# EAGLE design NT_SolarModule1 (EAGLE 9.2.0)
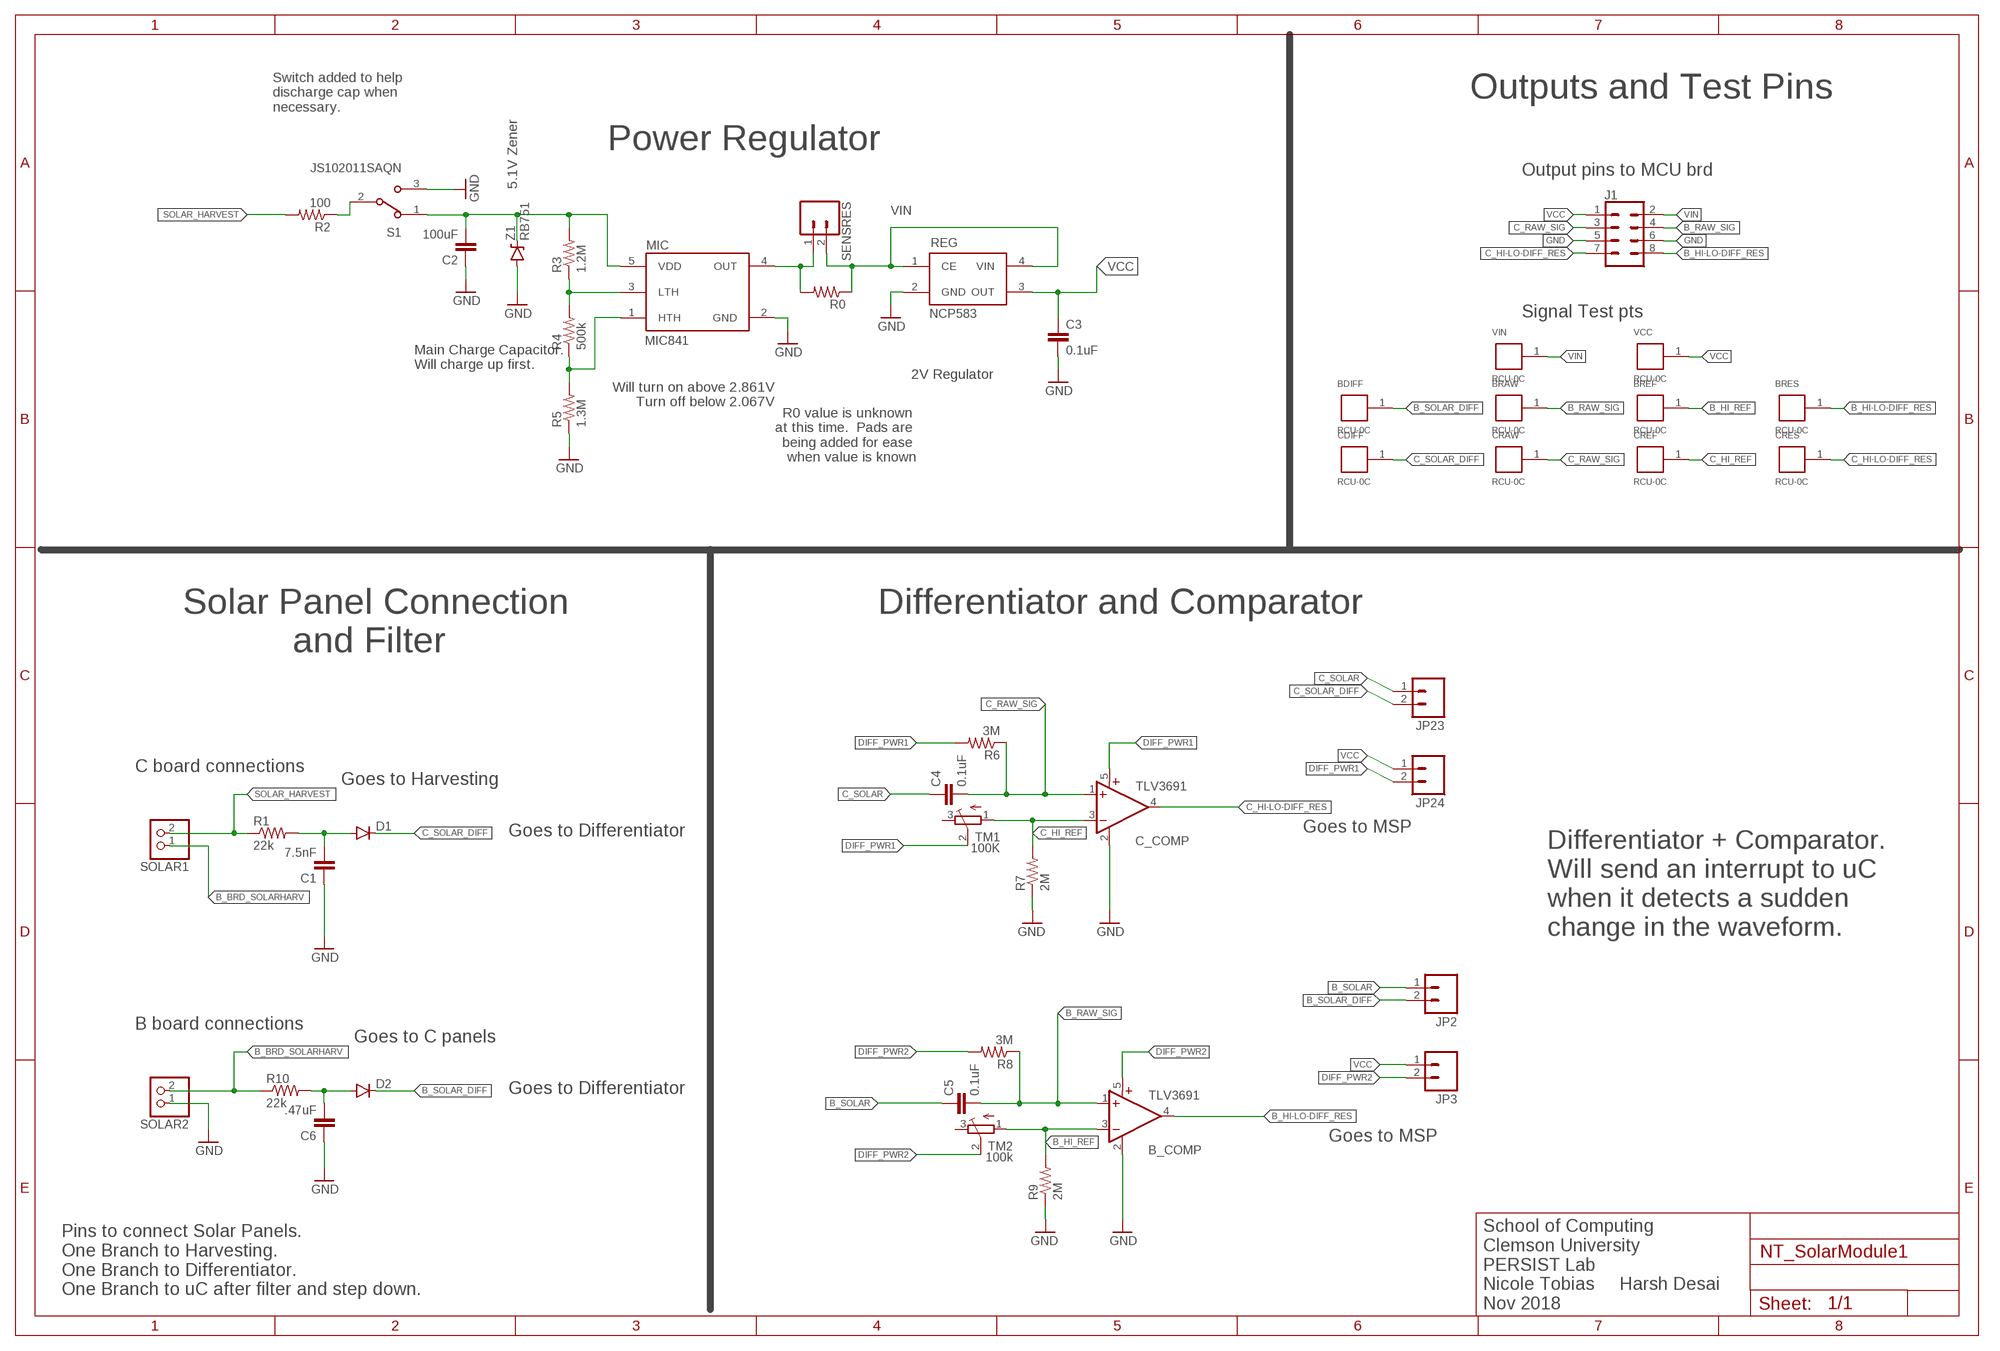
[diagram p0: schematic, sheet 1]

## Parts
B_COMP  TLV3691  [SC70-5]
BDIFF  RCU-0C  [TE_RCU-0C]
BRAW  RCU-0C  [TE_RCU-0C]
BREF  RCU-0C  [TE_RCU-0C]
BRES  RCU-0C  [TE_RCU-0C]
C1  7.5nF  CAP0603-CAP  [0603-CAP]
C2  100uF  CAP0603-CAP  [0603-CAP]
C3  0.1uF  CAP0603-CAP  [0603-CAP]
C4  0.1uF  CAP0603-CAP  [0603-CAP]
C5  0.1uF  CAP0603-CAP  [0603-CAP]
C6  .47uF  CAP0603-CAP  [0603-CAP]
C_COMP  TLV3691  [SC70-5]
CDIFF  RCU-0C  [TE_RCU-0C]
CRAW  RCU-0C  [TE_RCU-0C]
CREF  RCU-0C  [TE_RCU-0C]
CRES  RCU-0C  [TE_RCU-0C]
D1  DIODESOD523  [SOD523]
D2  DIODESOD523  [SOD523]
J1  CONN_04X2  [2X4]
JP2  M02  [1X02-1.27MM]
JP3  M02  [1X02-1.27MM]
JP23  M02  [1X02-1.27MM]
JP24  M02  [1X02-1.27MM]
MIC  MIC841  [SC70-5]
R0  RESISTOR0603  [0603-RES]
R1  22k  RESISTOR0603  [0603-RES]
R2  100  RESISTOR0603  [0603-RES]
R3  1.2M  RESISTOR0603  [0603-RES]
R4  500k  RESISTOR0603  [0603-RES]
R5  1.3M  RESISTOR0603  [0603-RES]
R6  3M  RESISTOR0603  [0603-RES]
R7  2M  RESISTOR0603  [0603-RES]
R8  3M  RESISTOR0603  [0603-RES]
R9  2M  RESISTOR0603  [0603-RES]
R10  22k  RESISTOR0603  [0603-RES]
REG  NCP583  [SC82-AB_1PRIMARY]
S1  JS102011SAQN  [SW_JS102011SAQN]
SENSRES  CONN_02  [1X02]
SOLAR1  PINHD-1X2  [1X02]
SOLAR2  PINHD-1X2  [1X02]
TM1  100K  TRIMPOTTC33X  [TC33X]
TM2  100k  TRIMPOTTC33X  [TC33X]
VCC  RCU-0C  [TE_RCU-0C]
VIN  RCU-0C  [TE_RCU-0C]
Z1  RB751  DIODE-ZENER  [SOD-523]

## Nets
B_BRD_SOLARHARV: R10.1 SOLAR1.1 SOLAR2.2
B_HI-LO-DIFF_RES: B_COMP.4(OUT) BRES.1 J1.8
B_HI_REF: B_COMP.3(-IN) BREF.1 R9.2 TM2.1(A)
B_RAW_SIG: B_COMP.1(+IN) BRAW.1 C5.2 J1.4 R8.1
B_SOLAR: C5.1 JP2.1
B_SOLAR_DIFF: BDIFF.1 D2.C JP2.2
C_HI-LO-DIFF_RES: C_COMP.4(OUT) CRES.1 J1.7
C_HI_REF: C_COMP.3(-IN) CREF.1 R7.2 TM1.1(A)
C_RAW_SIG: C4.2 C_COMP.1(+IN) CRAW.1 J1.3 R6.1
C_SOLAR: C4.1 JP23.1
C_SOLAR_DIFF: CDIFF.1 D1.C JP23.2
DIFF_PWR1: C_COMP.5(V+) JP24.2 R6.2 TM1.2(S)
DIFF_PWR2: B_COMP.5(V+) JP3.2 R8.2 TM2.2(S)
GND: B_COMP.2(GND) C1.1 C2.1 C3.2 C6.1 C_COMP.2(GND) J1.5 J1.6 MIC.2(GND) R5.1 R7.1 R9.1 REG.2(GND) S1.3 SOLAR2.1 Z1.ANODE(A)
MIC_INPUT: C2.2 MIC.5(VDD) R3.2 S1.1 Z1.CATHODE(C)
N$1: C6.2 D2.A R10.2
N$2: C1.2 D1.A R1.2
N$3: MIC.4(OUT) R0.2 SENSRES.1
N$6: R2.1 S1.2
N$11: MIC.3(LTH) R3.1 R4.2
N$12: MIC.1(HTH) R4.1 R5.2
SOLAR_HARVEST: R1.1 R2.2 SOLAR1.2
VCC: C3.1 J1.1 JP3.1 JP24.1 REG.3(OUT) VCC.1
VIN: J1.2 R0.1 REG.1(CE) REG.4(VIN) SENSRES.2 VIN.1
Unconnected: TM1.3(E) TM2.3(E)

## Notes on the sheet
- Outputs and Test Pins
- Switch added to help 
  discharge cap when 
  necessary.
- Power Regulator
- Output pins to MCU brd
- 5.1V Zener
- Signal Test pts
- Main Charge Capacitor.
  Will charge up first.
- 2V Regulator
- Will turn on above 2.861V
  Turn off below 2.067V
- R0 value is unknown 
  at this time.  Pads are 
  being added for ease 
  when value is known
- Differentiator and Comparator
- Solar Panel Connection
             and Filter
- C board connections
- Goes to Harvesting
- Goes to Differentiator | Goes to MSP
- Differentiator + Comparator.
  Will send an interrupt to uC 
  when it detects a sudden 
  change in the waveform.
- B board connections
- Goes to C panels
- Goes to Differentiator
- Goes to MSP
- Pins to connect Solar Panels.
  One Branch to Harvesting.
  One Branch to Differentiator.
  One Branch to uC after filter and step down.
- School of Computing
  Clemson University
  PERSIST Lab
  Nicole Tobias     Harsh Desai
  Nov 2018

## Library data of the parts
B_COMP C_COMP = fedpower:TLV3691: 0.9-V to 6.5-V, Nanopower Comparator Datasheets Analog Signal Chain Guide <http://www.ti.com/lit/pdf/slyb174> TLV3691 <http://www.ti.com/lit/ds/symlink/tlv3691.pdf> Manufacturer Product Page TLV3691IDPFR Specifications <http://www.ti.com/general/docs/suppproductinfo.tsp?distId=10&orderablePartNumber=TLV3691IDPFR> Standard Package <javascript:dlgHelp('Standard%20Packaging%20Help');> 1 Category Integrated Circuits (ICs) </product-search/en/integrated-circuits-ics> Family Linear - Comparators </product-search/en/integrated-circuits-ics/linear-comparators/2556221> Series - Packaging <javascript:dlgHelp('Standard%20Packaging%20Help');> Cut Tape (CT) <javascript:dlgHelp('Cut%20Tape%20Help');> Type General Purpose Number of Elements 1 Output Type Push-Pull Voltage - Supply, Single/Dual (±) 0.9 V ~ 6.5 V, ±0.45 V ~ 3.25 V Voltage - Input Offset (Max) 3mV Current - Input Bias (Max) 100pA Current - Output (Typ) 42mA Current - Quiescent (Max) 150nA CMRR, PSRR (Typ) - Propagation Delay (Max) 35µs Hysteresis - Operating Temperature -40°C ~ 125°C Package / Case 6-XFDFN Mounting Type Surface Mount Supplier Device Package 6-X2SON (1x1) Online Catalog Comparators - 1 element </catalog/en/partgroup/comparators-1-element/3112?mpart=TLV3691IDPFR&vendor=296&WT.z_ref_page_type=PS&WT.z_ref_page_sub_type=PD&WT.z_ref_page_id=PD&WT.z_ref_page_event=DC_Link_Table> Other Names 296-37242-1
BDIFF BRAW BREF BRES CDIFF CRAW CREF CRES VCC VIN = RCU-0C:RCU-0C: 0603 PROBE PAD; AVAILABILITY: Unavailable; COMMENT: RCU-0C _1625854-3_; DESCRIPTION: 0603 PROBE PAD; EU_ROHS_COMPLIANCE: Compliant; LINK: http://www.te.com/usa-en/product-1625854-3.html; MF: TE Connectivity; MP: RCU-0C; PACKAGE: 0603; POWER_RATING: 0 W; PRICE: None; RESISTANCE: <.05; TOLERANCE: 0%
C1-C6 = SparkFun-Capacitors:CAP: Capacitor Standard 0603 ceramic capacitor, and 0.1" leaded capacitor.
D1 D2 = SparkFun-DiscreteSemi:DIODE: Diode These are standard reverse protection diodes and small signal diodes. SMA package can handle up to about 1A. SOD-323 can handle about 200mA. What the SOD-323 package when ordering, there are some mfgs out there that are 5-pin packages.
J1 = SparkFun-Connectors:CONN_04X2: Multi connection point. Often used as Generic Header-pin footprint for 0.1 inch spaced/style header connections On any of the 0.1 inch spaced packages, you can populate with these: Break Away Headers - Straight <https://www.sparkfun.com/products/116> (PRT-00116) Break Away Male Headers - Right Angle <https://www.sparkfun.com/products/553> (PRT-00553) Female Headers <https://www.sparkfun.com/products/115> (PRT-00115) Break Away Headers - Machine Pin <https://www.sparkfun.com/products/117> (PRT-00117) Break Away Female Headers - Swiss Machine Pin <https://www.sparkfun.com/products/743> (PRT-00743)
JP2 JP3 JP23 JP24 = SparkFun-Connectors:M02: Standard 2-pin 0.1" header. Use with - straight break away headers ( PRT-00116) - right angle break away headers (PRT-00553) - swiss pins (PRT-00743) - machine pins (PRT-00117) - female headers (PRT-00115) Molex polarized connector foot print use with: PRT-08233 with associated crimp pins and housings. 2.54_SCREWTERM for use with PRT-10571. 3.5mm Screw Terminal footprints for PRT-08084 5mm Screw Terminal footprints for use with PRT-08432
MIC = mic841:MIC841: MIC841:Comparator with reference and adj. hysteresis
R0 R1-R10 = SparkFun-Resistors:RESISTOR: Resistor Basic schematic elements and footprints for 0603, 1206, and PTH resistors.
REG = ncp583:NCP583: NCP583 - Ultra-Low Iq 150 mA CMOS LDO Regulator with Enable The NCP583 series of low dropout regulators are designed for portable battery powered applications which require precise output voltage accuracy and low quiescent current. These devices feature an enable function which lowers current consumption significantly and are offered in two small packages; SC−82AB and the SOT−563. A 1.0 mF ceramic capacitor is the recommended value to be used with these devices on the output pin.
S1 = JS102011SAQN:JS102011SAQN: JS10 Series SPDT On-On 6 V 0.3 A Gull Wing SMT Slide Switch http://www.snapeda.com/parts/JS102011SAQN/C%26K%20Components/view-part/; AVAILABILITY: Good; DESCRIPTION: SWITCH SLIDE SPDT 300MA 6V; MF: C&K Components; MP: JS102011SAQN; PACKAGE: None; PRICE: 0.35 USD
SENSRES = SparkFun-Connectors:CONN_02: Multi connection point. Often used as Generic Header-pin footprint for 0.1 inch spaced/style header connections On any of the 0.1 inch spaced packages, you can populate with these: Break Away Headers - Straight <https://www.sparkfun.com/products/116> (PRT-00116) Break Away Male Headers - Right Angle <https://www.sparkfun.com/products/553> (PRT-00553) Female Headers <https://www.sparkfun.com/products/115> (PRT-00115) Break Away Headers - Machine Pin <https://www.sparkfun.com/products/117> (PRT-00117) Break Away Female Headers - Swiss Machine Pin <https://www.sparkfun.com/products/743> (PRT-00743) For SCREWTERMINALS and SPRING TERMINALS visit here: Screw Terimnals on SparkFun.com <https://www.sparkfun.com/search/results?term=Screw+Terminals> (5mm/3.5mm/2.54mm spacing) This device is also useful as a general connection point to wire up your design to another part of your project. Our various solder wires solder well into these plated through hole pads. Hook-Up Wire - Assortment (Stranded, 22 AWG) <https://www.sparkfun.com/products/11375> (PRT-11375) Hook-Up Wire - Assortment (Solid Core, 22 AWG) <https://www.sparkfun.com/products/11367> (PRT-11367) View the entire wire category on our website here <https://www.sparkfun.com/categories/141> Special notes: Molex polarized connector foot print use with: PRT-08233 with associated crimp pins and housings. 2.54_SCREWTERM for use with PRT-10571. 3.5mm Screw Terminal footprints for PRT-08084 5mm Screw Terminal footprints for use with PRT-08432
SOLAR1 SOLAR2 = pinhead:PINHD-1X2: PIN HEADER
TM1 TM2 = adafruit:TRIMPOT: SMT trimmer potentiometer part number TC33X http://www.ladyada.net/library/eagle
Z1 = Parts:DIODE-ZENER: Zener Diode Production Part - 8199 3.4V Zener Voltage

## Board
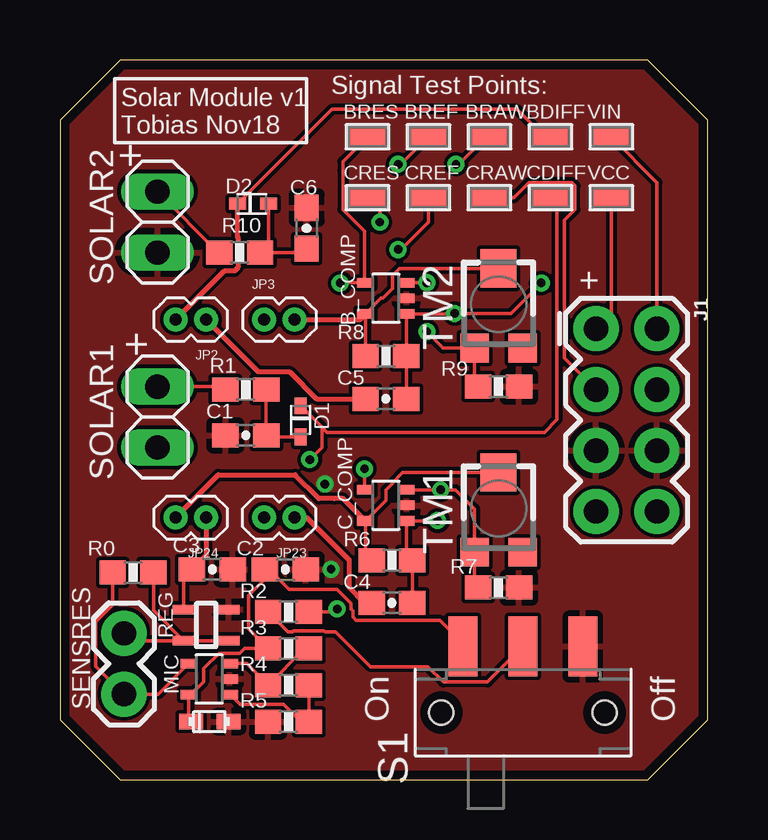
[diagram p1: board, top side]
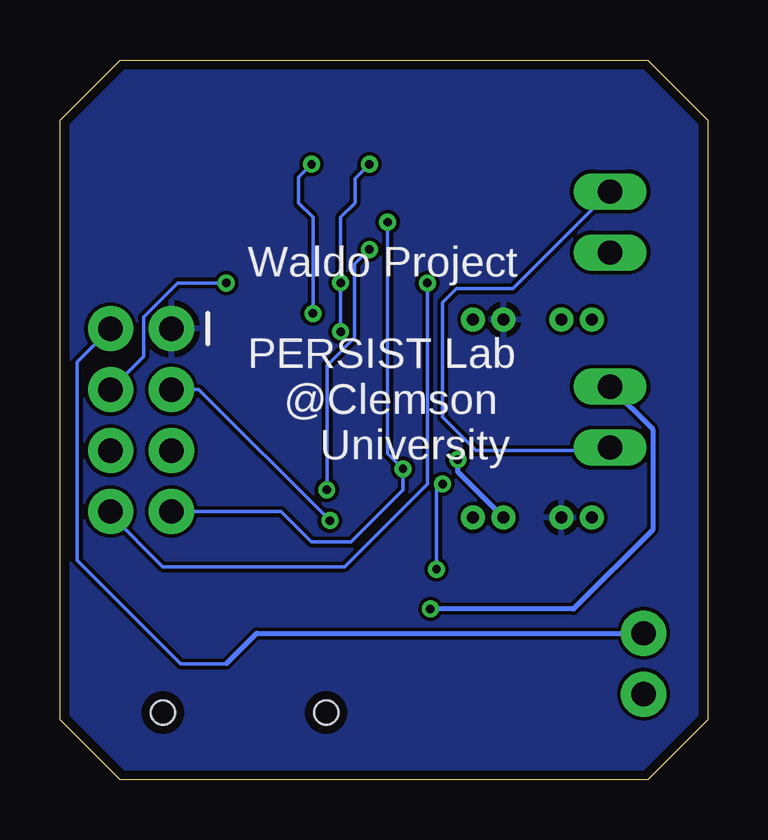
[diagram p2: board, bottom side, seen from below]

Size 27 x 30 mm. Coordinates in mm from the lower left corner, seen from the top.
Outline: 2.5,0 24.5,0 27,2.5 27,27.5 24.5,30 2.5,30 0,27.5 0,2.5 2.5,0
Copper layers (1*16): Top 0.0356mm / dielectric 1.5011mm / Bottom 0.0356mm
Design rules "oshpark-2layer *": minimum track width 6mil, minimum drill 13mil, track to track 6mil, track to pad 6mil, pad to pad 6mil, via to via 6mil, smd to smd 6mil, copper to edge 15mil, drill to drill 6mil, minimum pad ring 7mil, minimum via ring 7mil, stop-mask expansion 2.5mil, vias tented up to drill 14mil, thermal gap 10mil

### Footprints (pad centres in the part's own frame; a part is rotated, then mirrored left to right if it is on the bottom)
SC70-5 = smd 0.4 x 0.7: 1 -0.65,-0.85; 2 0,-0.85; 3 0.65,-0.85; 4 0.65,0.85; 5 -0.65,0.85
TE_RCU-0C = smd 1.6 x 0.8: 1 0,0
0603-CAP = smd 1.1 x 1: 1 -0.85,0; 2 0.85,0
SOD523 = smd 0.7 x 0.5: A 0.7,0; C -0.6,0
2X4 = drill 1.016 pad 1.88: 1 -3.81,-1.27; 2 -3.81,1.27; 3 -1.27,-1.27; 4 -1.27,1.27; 5 1.27,-1.27; 6 1.27,1.27; 7 3.81,-1.27; 8 3.81,1.27
1X02-1.27MM = drill 0.508 pad 1: 1 0,0; 2 1.27,0
0603-RES = smd 1.1 x 1: 1 -0.85,0; 2 0.85,0
SC82-AB_1PRIMARY = smd 0.406 x 0.914: 1 -1.321,-0.813; 2 -0.025,-0.813; 3 -0.025,1.067; 4 -1.321,1.067
SW_JS102011SAQN = smd 1.2 x 2.5: 1 -2.5,2.75; 2 0,2.75; 3 2.5,2.75 | hole 1: -3.4,0; 3.4,0
1X02 = drill 1.016 pad 1.88: 1 0,0; 2 2.54,0
1X02' = drill 1.016 long: 1 -1.27,0; 2 1.27,0
TC33X = smd 1.2 x 1.2: 1 -1,-1.825; 3 1,-1.825 | smd 1.5 x 1.6: 2 0,1.5
SOD-523 = smd 1 x 0.635: ANODE -0.8,0; CATHODE 0.76,0

### Placement (x,y rotation side)
B_COMP  13.59,20.07 90 top
BDIFF  20.45,26.8 0 top
BRAW  17.91,26.8 0 top
BREF  15.37,26.8 0 top
BRES  12.83,26.8 0 top
C1  7.75,14.35 0 top
C2  9.4,8.76 180 top
C3  6.35,8.76 0 top
C4  13.84,7.37 0 top
C5  13.59,15.88 0 top
C6  10.29,22.99 270 top
C_COMP  13.59,11.43 90 top
CDIFF  20.45,24.26 0 top
CRAW  17.91,24.26 0 top
CREF  15.37,24.26 0 top
CRES  12.83,24.26 0 top
D1  10.03,14.99 270 top
D2  8,24 0 top
J1  23.62,14.99 270 top
JP2  6.1,19.18 180 top
JP3  8.51,19.18 0 top
JP23  9.78,10.92 180 top
JP24  6.1,10.92 180 top
MIC  6.22,4.19 90 top
R0  3.05,8.64 180 top
R1  7.75,16.26 0 top
R2  9.53,6.99 0 top
R3  9.53,5.46 180 top
R4  9.53,3.94 180 top
R5  9.53,2.41 0 top
R6  13.84,9.14 180 top
R7  18.29,8 180 top
R8  13.59,17.65 180 top
R9  18.29,16.38 180 top
R10  7.49,21.97 0 top
REG  6.22,7.11 90 top
S1  19.3,2.79 0 top
SENSRES  2.67,3.56 90 top
SOLAR1  [1X02']  4.06,15.11 90 top
SOLAR2  [1X02']  4.06,23.24 90 top
TM1  18.29,11.3 0 top
TM2  18.29,19.81 0 top
VCC  22.99,24.26 0 top
VIN  22.99,26.8 0 top
Z1  6.22,2.41 180 top

### Tracks (layer width: path | path; a pad name or v marks a point on that pad's centre or on a via)
B_BRD_SOLARHARV
  Top 0.152: SOLAR2.2 6.6,21.97 R10.1
  Bottom 0.152: SOLAR1.1 4.19,13.72 9.65,13.72 11.05,15.11 11.05,19.88 10.47,20.46 8.12,20.46 SOLAR2.2
B_HI-LO-DIFF_RES  (via drill 0.35)
  Top 0.152: B_COMP.4 12.7,20.72 | 12.7,20.72 11.7,20.72 v11.68,20.7 | 12.7,20.72 12.7,22.86 11.8,23.76 11.8,25.4 11.8,25.77 BRES.1
  Bottom 0.152: v11.68,20.7 11.68,12.32 15.14,8.87 22.71,8.87 24.89,11.05 J1.8
B_HI_REF  (via drill 0.35)
  Top 0.152: v15.29,20.72 B_COMP.3 | v15.29,18.67 15.98,17.99 TM2.1 17.29,16.53 R9.2 | BREF.1 14.22,25.65 v14.1,25.65
  Bottom 0.152: v15.29,18.67 v15.29,20.72 15.29,23.44 14.71,24.03 14.71,25.04 v14.1,25.65
B_RAW_SIG  (via drill 0.35)
  Top 0.152: C5.2 R8.1 B_COMP.1 16.44,19.42 v16.46,19.43 18.8,19.43 v20.07,20.7 | BRAW.1 17.78,26.8 16.64,25.65 v16.51,25.65
  Bottom 0.152: v16.46,19.43 16.46,23.44 17.04,24.03 17.04,25.12 v16.51,25.65 | J1.4 23.52,17.63 23.52,19.28 22.1,20.7 v20.07,20.7
B_SOLAR
  Top 0.203: JP2.1 8.26,17.01 9.57,17.01 10.7,15.88 C5.1
B_SOLAR_DIFF
  Top 0.152: BDIFF.1 20.19,26.8 19.05,27.94 11.34,27.94 D2.C
  Top 0.203: D2.C 7.4,22.62 7.45,22.58 7.45,21.37 7.3,21.22 6.87,21.22 JP2.2
C_HI-LO-DIFF_RES  (via drill 0.35)
  Top 0.152: C_COMP.4 12.7,12.12 v12.7,12.95 | CRES.1 13.34,23.75 v13.34,23.24
  Bottom 0.152: J1.7 17.78,11.18 16.51,9.91 14.86,9.91 12.7,12.06 v12.7,12.95 13.34,13.59 v13.34,23.24
C_HI_REF  (via drill 0.35)
  Top 0.152: R7.2 17.29,8.15 TM1.1 17.29,11.29 16.5,12.08 v15.88,12.08 C_COMP.3 | CREF.1 15.37,23.24 14.1,21.97 v14.1,22.1
  Bottom 0.152: v14.1,22.1 14.71,21.48 14.71,18.43 15.88,17.27 v15.88,12.08
C_RAW_SIG  (via drill 0.35)
  Top 0.152: C4.2 R6.1 14.44,9.45 C_COMP.1 15.73,10.78 v15.75,10.79 | J1.3 21.03,17.58 21.03,23.32 21.48,23.76 21.48,24.75 21.34,24.89 19.55,24.89 18.92,24.26 CRAW.1
  Bottom 0.152: J1.3 21.21,16.26 v15.75,10.79
C_SOLAR
  Top 0.203: C4.1 12.7,7.37 12.06,8 12.06,9.14 10.29,10.92 JP23.1
C_SOLAR_DIFF  (via drill 0.35)
  Top 0.152: 10.92,14.7 10.92,13.84 v10.41,13.34 | 10.92,14.7 11.14,14.48 20.19,14.48 20.73,15.01 20.73,24.13 20.6,24.26 CDIFF.1 | D1.C 10.92,14.7
  Bottom 0.203: v10.41,13.34 10.41,12.83 JP23.2
DIFF_PWR1
  Top 0.152: TM1.2 14.29,12.8 13.86,12.38 13.86,12.34 13.59,12.06 13.59,11.63 C_COMP.5 12.74,9.4 R6.2
  Top 0.203: JP24.2 6.6,12.7 9.81,12.7 10.8,11.71 11.43,11.71 11.81,11.71 C_COMP.5
DIFF_PWR2
  Top 0.152: R8.2 B_COMP.5 13.39,20.07 13.46,20.07 13.86,20.46 13.86,21.01 14.16,21.31 TM2.2
  Top 0.203: JP3.2 12.5,19.18 B_COMP.5
GND  (via drill 0.35)
  Bottom 0.152: v11.05,12.32 11.3,12.06 v11.3,8.76
  pour Top: -2.54,33.02 27.94,33.02 27.94,-3.81 -2.54,-3.81
MIC_INPUT
  Top 0.152: Z1.CATHODE 5.37,2.5 MIC.5 5.41,3.5 5.99,4.08 5.99,4.63 6.63,5.27 7.5,5.27 7.69,5.46 R3.2 8.67,5.49 7.87,6.29 7.87,7.68 8.5,8.31 C2.2 8.72,8.76 9.55,7.93 11.56,7.93 12.14,7.35 12.14,7.11 12.21,7.04 12.21,6.77 12.35,6.64 15.84,6.64 16.8,5.67 S1.1
N$1
  Top 0.152: D2.A 8.7,22.33 R10.2 10.12,21.97 C6.2
N$2
  Top 0.152: R1.2 C1.2 8.66,14.29 D1.A
N$3
  Top 0.152: R0.2 2.2,7.28 1.5,6.58 1.5,4.72 SENSRES.1 4.09,3.56 MIC.4
N$6
  Top 0.152: S1.2 17.82,4.07 15.98,4.07 15.35,4.7 12.95,4.7 11.5,6.16 11.05,6.16 11.02,6.19 9.73,6.19 9.7,6.16 9.5,6.16 R2.1
N$11
  Top 0.152: MIC.3 7.77,4.84 R4.2 10.2,5.46 R3.1
N$12
  Top 0.152: MIC.1 7.09,3.56 7.5,3.14 9.32,3.14 10.05,2.41 R5.2 R4.1
SOLAR_HARVEST  (via drill 0.35)
  Top 0.152: v11.56,7.11 11.43,6.99 R2.2 | SOLAR1.2 6.77,16.38 R1.1
  Bottom 0.152: v11.56,7.11 11.43,7.11
  Bottom 0.203: SOLAR1.2 2.29,14.61 2.29,10.41 5.59,7.11 11.43,7.11
VCC
  Top 0.152: REG.3 5.16,8.36 C3.1 | VCC.1 22.99,19.43 J1.1
  Top 0.203: C3.1 6.1,9.36 JP24.1
  pour Bottom: -3.81,31.75 29.21,31.75 29.21,-3.81 -3.81,-3.81
VIN
  Top 0.152: REG.1 REG.4 | R0.1 3.9,7.05 REG.4 | REG.4 2.97,5.79 SENSRES.2 | J1.2 24.89,24.89 VIN.1
  Bottom 0.152: 20.07,4.83 21.97,4.83 26.29,9.14 26.29,17.4 J1.2
  Bottom 0.203: 20.07,4.83 18.8,6.1 SENSRES.2

### Text on the board
tPlace: Signal Test Points: | Solar Module v1 / Tobias Nov18 | + | + | + | On | Off
bPlace: Waldo Project / / PERSIST Lab / @Clemson / University